# Altium schematic sheet MAX3462.SchDoc
size A4
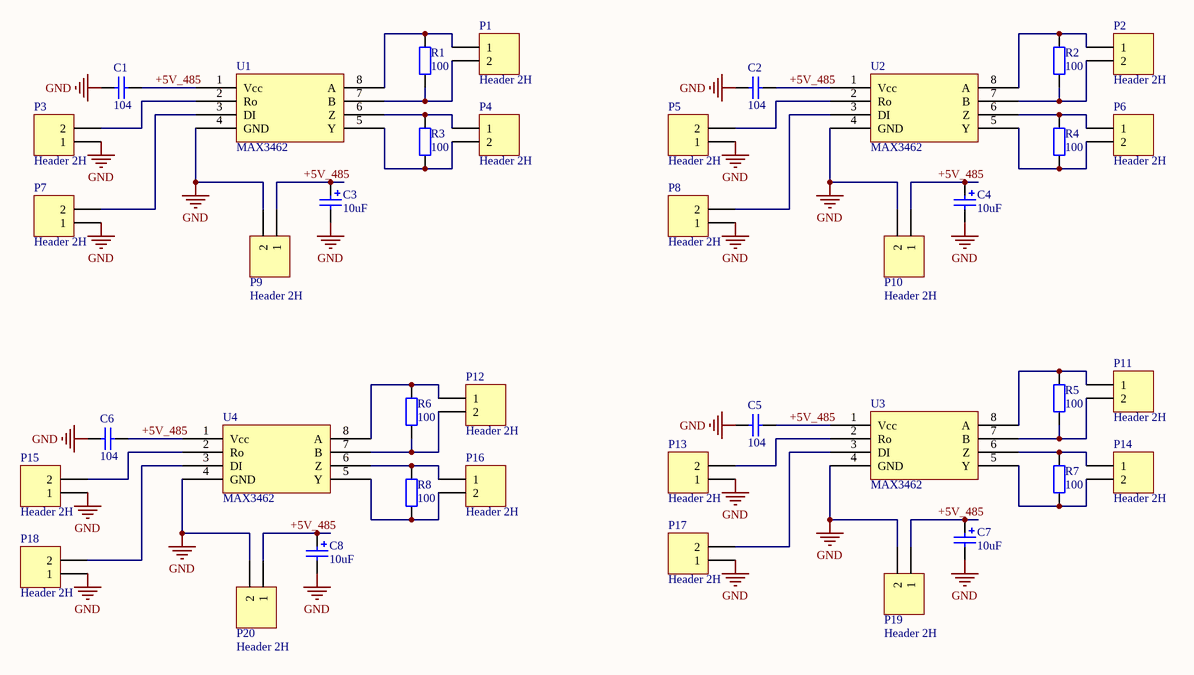
[diagram p0: MAX3462.SchDoc]

## Parts
C1  104  [0805C]
C2  104  [0805C]
C3  10uF  [C68uF]
C4  10uF  [C68uF]
C5  104  [0805C]
C6  104  [0805C]
C7  10uF  [C68uF]
C8  10uF  [C68uF]
P1  Header 2H  [HDR1X2]
P2  Header 2H  [HDR1X2]
P3  Header 2H  [HDR1X2]
P4  Header 2H  [HDR1X2]
P5  Header 2H  [HDR1X2]
P6  Header 2H  [HDR1X2]
P7  Header 2H  [HDR1X2]
P8  Header 2H  [HDR1X2]
P9  Header 2H  [HDR1X2]
P10  Header 2H  [HDR1X2]
P11  Header 2H  [HDR1X2]
P12  Header 2H  [HDR1X2]
P13  Header 2H  [HDR1X2]
P14  Header 2H  [HDR1X2]
P15  Header 2H  [HDR1X2]
P16  Header 2H  [HDR1X2]
P17  Header 2H  [HDR1X2]
P18  Header 2H  [HDR1X2]
P19  Header 2H  [HDR1X2]
P20  Header 2H  [HDR1X2]
R1  100  [0805R]
R2  100  [0805R]
R3  100  [0805R]
R4  100  [0805R]
R5  100  [0805R]
R6  100  [0805R]
R7  100  [0805R]
R8  100  [0805R]
U1  MAX3462  [SO8]
U2  MAX3462  [SO8]
U3  MAX3462  [SO8]
U4  MAX3462  [SO8]

## Nets
GND: C1.1 C2.1 C3.2 C4.2 C5.1 C6.1 C7.2 C8.2 P3.1 P5.1 P7.1 P8.1 P9.2 P10.2 P13.1 P15.1 P17.1 P18.1 P19.2 P20.2 U1.4(GND) U2.4(GND) U3.4(GND) U4.4(GND)
+5V_485: C1.2 C2.2 C3.1 C4.1 C5.2 C6.2 C7.1 C8.1 P9.1 P10.1 P19.1 P20.1 U1.1(Vcc) U2.1(Vcc) U3.1(Vcc) U4.1(Vcc)
NetP1_1: P1.1 R1.2 U1.8(A)
NetP1_2: P1.2 R1.1 U1.7(B)
NetP2_1: P2.1 R2.2 U2.8(A)
NetP2_2: P2.2 R2.1 U2.7(B)
NetP3_2: P3.2 U1.2(Ro)
NetP4_1: P4.1 R3.2 U1.6(Z)
NetP4_2: P4.2 R3.1 U1.5(Y)
NetP5_2: P5.2 U2.2(Ro)
NetP6_1: P6.1 R4.2 U2.6(Z)
NetP6_2: P6.2 R4.1 U2.5(Y)
NetP7_2: P7.2 U1.3(DI)
NetP8_2: P8.2 U2.3(DI)
NetP11_1: P11.1 R5.2 U3.8(A)
NetP11_2: P11.2 R5.1 U3.7(B)
NetP12_1: P12.1 R6.2 U4.8(A)
NetP12_2: P12.2 R6.1 U4.7(B)
NetP13_2: P13.2 U3.2(Ro)
NetP14_1: P14.1 R7.2 U3.6(Z)
NetP14_2: P14.2 R7.1 U3.5(Y)
NetP15_2: P15.2 U4.2(Ro)
NetP16_1: P16.1 R8.2 U4.6(Z)
NetP16_2: P16.2 R8.1 U4.5(Y)
NetP17_2: P17.2 U3.3(DI)
NetP18_2: P18.2 U4.3(DI)

## Library data of the parts
C1 C2 C5 C6 = Cap: Capacitor; Value: 100nF; Published: 8-Jun-2000; LatestRevisionDate: 17-Jul-2002; LatestRevisionNote: Re-released for DXP Platform.; PackageReference: RAD-0.3; Publisher: Altium Limited
C3 C4 C7 C8 = Cap Pol2: Polarized Capacitor (Axial); Value: 100pF; Published: 8-Jun-2000; LatestRevisionDate: 17-Jul-2002; LatestRevisionNote: Re-released for DXP Platform.; PackageReference: POLAR0.8; Publisher: Altium Limited
P1-P20 = Header 2H: Header, 2-Pin, Right Angle; LatestRevisionDate: 17-Jul-2002; LatestRevisionNote: Re-released for DXP Platform.; Publisher: Altium Limited
R1-R8 = Res2: Resistor; Value: 1K; Published: 8-Jun-2000; LatestRevisionDate: 17-Jul-2002; LatestRevisionNote: Re-released for DXP Platform.; PackageReference: AXIAL-0.4; Publisher: Altium Limited